# Altium schematic sheet can.SchDoc
size A4
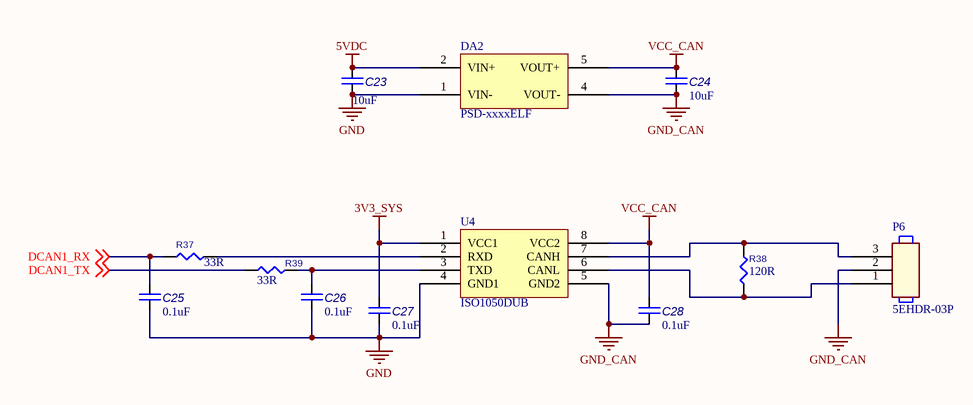
[diagram p0: can.SchDoc]

## Parts
C23  value 10uF  [CC2012-0805]  (hidden comment: C0805)
C24  value 10uF  [CC2012-0805]  (hidden comment: C0805)
C25  value 0.1uF  [CC1608-0603]  (hidden comment: C0603)
C26  value 0.1uF  [CC1608-0603]  (hidden comment: C0603)
C27  value 0.1uF  [CC1608-0603]  (hidden comment: C0603)
C28  value 0.1uF  [CC1608-0603]  (hidden comment: C0603)
DA2  PSD-xxxxELF  [PSD-xxxxELF]
P6  P/N: 5EHDR-03P  [TE_282814-3]  (hidden comment: TE_282814-3)
R37  value 33R  [RESC1608X55N]  (hidden comment: R0603)
R38  value 120R  [RESC1608X55N]  (hidden comment: R0603)
R39  value 33R  [RESC1608X55N]  (hidden comment: R0603)
U4  ISO1050DUB  [SO-G8/Z10.8]

## Nets
3V3_SYS: C27.1 U4.1(VCC1)
5VDC: C23.2 DA2.2(VIN+)
GND: C23.1 C25.2 C26.2 C27.2 DA2.1(VIN-) U4.4(GND1)
GND_CAN: C24.1 C28.2 DA2.4(VOUT-) P6.2 U4.5(GND2)
VCC_CAN: C24.2 C28.1 DA2.5(VOUT+) U4.8(VCC2)
DCAN1_RX: C25.1 R37.2 ; off-sheet DCAN1_RX
DCAN1_TX: R39.2 ; off-sheet DCAN1_TX
NetC26_1: C26.1 R39.1 U4.3(TXD)
NetP6_1: P6.1 R38.1 U4.6(CANL)
NetP6_3: P6.3 R38.2 U4.7(CANH)
NetR37_1: R37.1 U4.2(RXD)

## Library data of the parts
DA2 = PSD-xxxxELF: single output isolated DC/DC converter; Manufacturer: PEAK electronics; P/N: PSD-0505ELF
P6 = TE_282814-3: Terminal Block Connectors
U4 = ISO1050DUB: ISOLATED CAN TRANSCEIVER; Manufacturer: TI; P/N: ISO1050DUBR
C23 C24 = C0805: P/N: *
C25-C28 = C0603: P/N: *
R37-R39 = R0603: P/N: *